# Altium schematic sheet mlx-brd1_091-mcu.SchDoc
size Letter
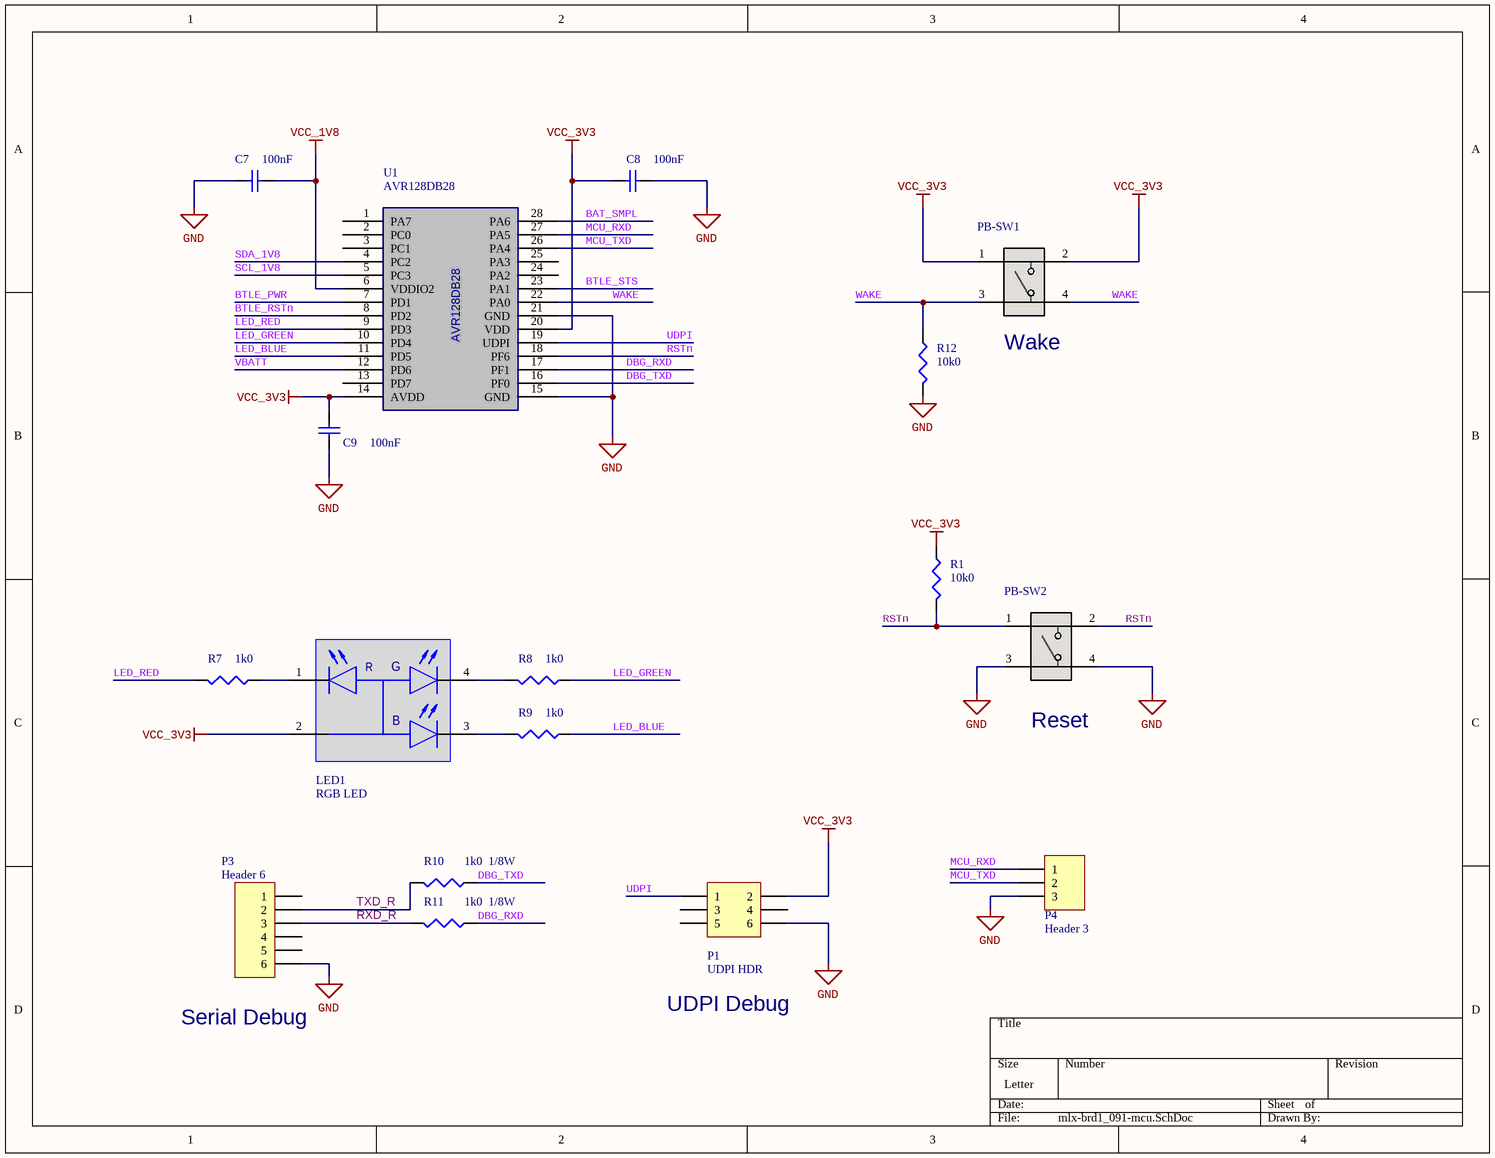
[diagram p0: mlx-brd1_091-mcu.SchDoc]

## Parts
C7  100nF  [CAPC1608N]
C8  100nF  [CAPC1608N]
C9  100nF  [CAPC1608N]
LED1  RGB LED  [SOL150P350X210-4N]
P1  UDPI HDR  [HDR2X3]
P3  Header 6  [HDR1X6]
P4  Header 3  [HDR1X3]
PB-SW1  PTS645SM43SMTR92LFS  [SWITCH_43SMTR92LFS]  (value not drawn)
PB-SW2  PTS645SM43SMTR92LFS  [SWITCH_43SMTR92LFS]  (value not drawn)
R1  10k0  [RESC1608N]
R7  1k0  [RESC1608N]
R8  1k0  [RESC1608N]
R9  1k0  [RESC1608N]
R10  value 1k0  1/8W  [RESC1608N]  (hidden comment: Res3)
R11  value 1k0  1/8W  [RESC1608N]  (hidden comment: Res3)
R12  10k0  [RESC1608N]
U1  AVR128DB28  [AVR128DB28_SOIC28]

## Nets
GND: C7.2 C8.1 C9.1 P1.6 P3.6 P4.3 PB-SW2.3 PB-SW2.4 R12.2 U1.15(GND) U1.21(GND)
VCC_1V8: C7.1 U1.6(VDDIO2)
VCC_3V3: C8.2 C9.2 LED1.2(CA) P1.2 PB-SW1.1 PB-SW1.2 R1.1 U1.14(AVDD) U1.20(VDD)
BAT_SMPL: U1.28(PA6)
BTLE_PWR: U1.7(PD1)
BTLE_RSTn: U1.8(PD2)
BTLE_STS: U1.23(PA1)
DBG_RXD: R11.1 U1.17(PF1)
DBG_TXD: R10.1 U1.16(PF0)
LED_BLUE: R9.1 U1.11(PD5)
LED_GREEN: R8.1 U1.10(PD4)
LED_RED: R7.2 U1.9(PD3)
MCU_RXD: P4.1 U1.27(PA5)
MCU_TXD: P4.2 U1.26(PA4)
RSTn: PB-SW2.1 PB-SW2.2 R1.2 U1.18(PF6)
RXD_R: P3.3 R11.2
SCL_1V8: U1.5(PC3)
SDA_1V8: U1.4(PC2)
TXD_R: P3.2 R10.2
UDPI: P1.1 U1.19(UDPI)
VBATT: U1.12(PD6)
WAKE: PB-SW1.3 PB-SW1.4 R12.1 U1.22(PA0)
NetLED1_1: LED1.1(RED_C) R7.1
NetLED1_3: LED1.3(BLUE_C) R9.2
NetLED1_4: LED1.4(GREEN_C) R8.2

Not connected (* = marked no-connect by the designer): P1 3 4 5; P3 1 4 5; U1 1(PA7) 2(PC0) 3(PC1) 13(PD7) 24(PA2) 25(PA3)

## Notes on the sheet
- (near PB-SW1) Wake
- (near PB-SW2) Reset
- (near P3) Serial Debug
- UDPI Debug
- (in symbol CLVBA-FKA-CAEDH8BBB7A363) R; G; B

## Library data of the parts
C7-C9 = Cap: Capacitor; Manufacturer: Yageo; MPN: CC0603KPX7R9BB104; Value: CAP CER 0.1UF 50V X7R 0603; Digi-Key PN: 311-3567-1-ND
LED1 = CLVBA-FKA-CAEDH8BBB7A363: Red, Green, Blue _RGB_ 622nm Red, 530nm Green, 470nm Blue LED Indication - Discrete 1.9V Red, 3V Green, 3V Blue 4-PLCC; Manufacturer: CreeLED, Inc.; Value: LED RGB DIFFUSED 4PLCC SMD; Digi-Key PN: CLVBA-FKA-CAEDH8BBB7A363CT-ND; MPN: CLVBA-FKA-CAEDH8BBB7A363
P1 = Header 3X2: Header, 3-Pin, Dual row; Digi-Key PN: n/a; Value: n/a; Manufacturer: n/a; MPN: n/a
P3 = Header 6: Header, 6-Pin
P4 = Header 3: Header, 3-Pin
PB-SW1 PB-SW2 = PTS645SM43SMTR92LFS: No Description Available; Manufacturer: C&K; Value: SWITCH TACTILE SPST-NO 0.05A 12V; Digi-Key PN: CKN9112CT-ND; MPN: PTS645SM43SMTR92LFS
R1 R7-R9 R12 = Res3: Resistor; Manufacturer: Stackpole Electronics Inc; MPN: CF18JT10K0; Value: RES 10K OHM 1/8W 5% CF AXIAL; Digi-Key PN: CF18JT10K0CT-ND
R10 R11 = Res3: Manufacturer: Stackpole; MPN: CF18JT1K00; Digi-Key PN: CF18JT1K00CT-ND
U1 = AVR128DB28: 28 SDIP AVR DB microcontroller; Manufacturer: Microchip Technology; value: AVR DB Microcontroller; MPN: AVR128DB28